# Altium schematic sheet P06_LED, Config.SchDoc
size 386 x 246 mm
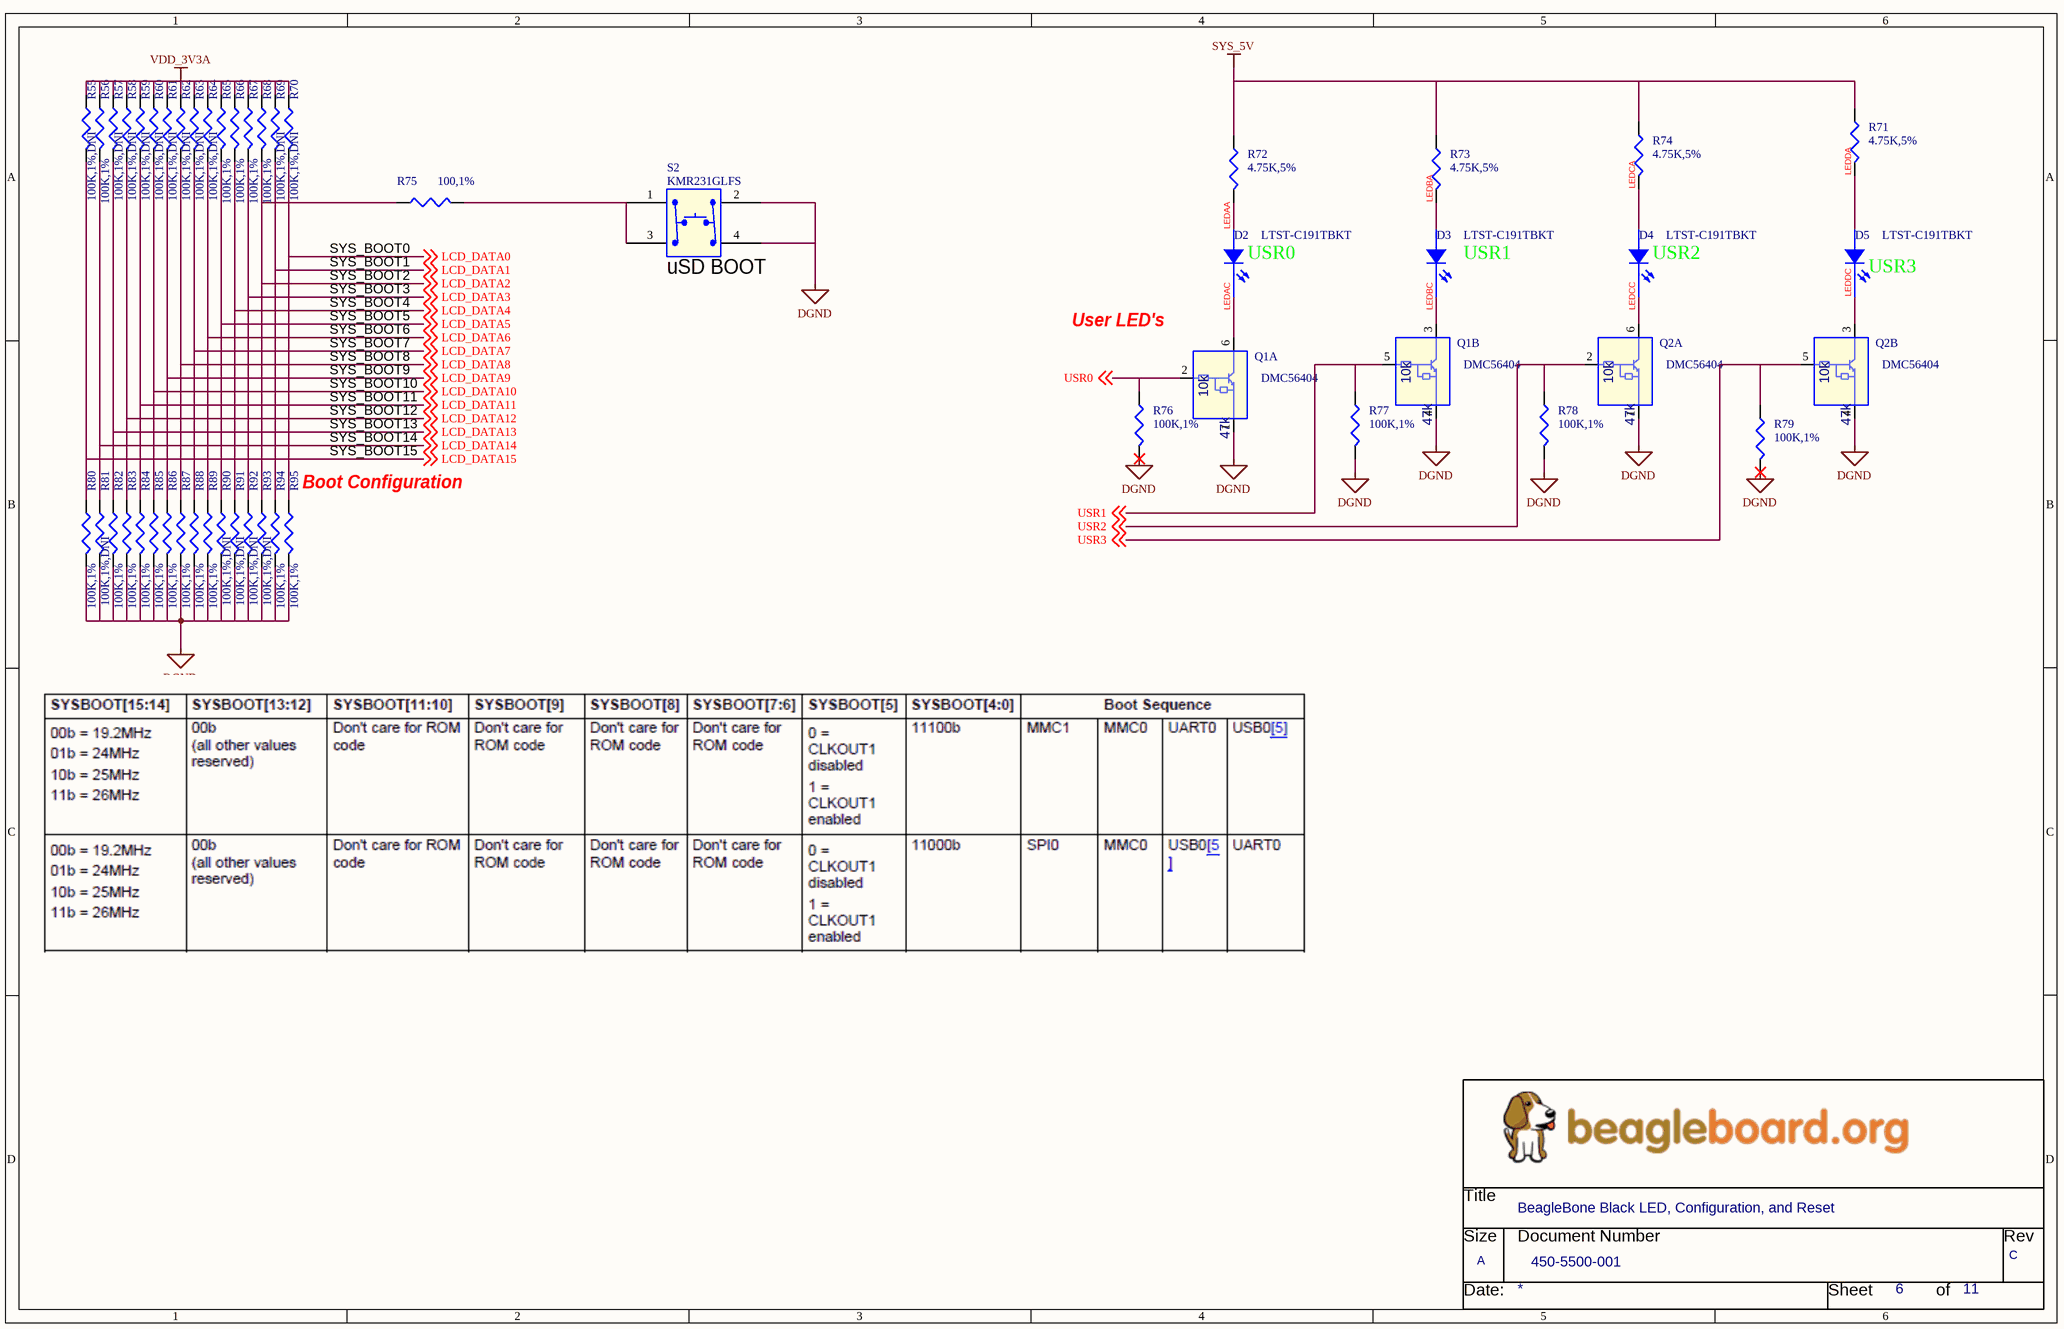
[diagram p0: P06_LED, Config.SchDoc]

## Parts
*  Page Count: 11  Page Number: 6  Page Size: A  Title: BeagleBone Black LED, Configuration, and Reset  RevCode: C  Doc: 450-5500-001  (hidden comment: BeagleBoard_org)  (graphical)
D2  LTST-C191TBKT  [led1206-59x59]
D3  LTST-C191TBKT  [led1206-59x59]
D4  LTST-C191TBKT  [led1206-59x59]
D5  LTST-C191TBKT  [led1206-59x59]
Q1  DMC56404  [P-SOT363-6-1]  (parts A,B of 2)
Q2  DMC56404  [P-SOT363-6-1]  (parts A,B of 2)
R55  100K,1%,DNI  [402]
R56  100K,1%  [402]
R57  100K,1%,DNI  [402]
R58  100K,1%,DNI  [402]
R59  100K,1%,DNI  [402]
R60  100K,1%,DNI  [402]
R61  100K,1%,DNI  [402]
R62  100K,1%,DNI  [402]
R63  100K,1%,DNI  [402]
R64  100K,1%,DNI  [402]
R65  100K,1%  [402]
R66  100K,1%  [402]
R67  100K,1%  [402]
R68  100K,1%  [402]
R69  100K,1%,DNI  [402]
R70  100K,1%,DNI  [402]
R71  4.75K,5%  [402]
R72  4.75K,5%  [402]
R73  4.75K,5%  [402]
R74  4.75K,5%  [402]
R75  100,1%  [402]
R76  100K,1%  [402]
R77  100K,1%  [402]
R78  100K,1%  [402]
R79  100K,1%  [402]
R80  100K,1%  [402]
R81  100K,1%,DNI  [402]
R82  100K,1%  [402]
R83  100K,1%  [402]
R84  100K,1%  [402]
R85  100K,1%  [402]
R86  100K,1%  [402]
R87  100K,1%  [402]
R88  100K,1%  [402]
R89  100K,1%  [402]
R90  100K,1%,DNI  [402]
R91  100K,1%,DNI  [402]
R92  100K,1%,DNI  [402]
R93  100K,1%,DNI  [402]
R94  100K,1%  [402]
R95  100K,1%  [402]
S2  KMR231GLFS  [SM-SW-SPST-4-4]

## Nets
DGND: Q1.1 Q1.4 Q2.1 Q2.4 R76.2 R77.2 R78.2 R79.2 R80.2 R81.2 R82.2 R83.2 R84.2 R85.2 R86.2 R87.2 R88.2 R89.2 R90.2 R91.2 R92.2 R93.2 R94.2 R95.2 S2.2(B1) S2.4(B2)
SYS_5V: R71.1 R72.1 R73.1 R74.1
VDD_3V3A: R55.1 R56.1 R57.1 R58.1 R59.1 R60.1 R61.1 R62.1 R63.1 R64.1 R65.1 R66.1 R67.1 R68.1 R69.1 R70.1
LCD_DATA0: R70.2 R95.1 ; off-sheet LCD_DATA0
LCD_DATA1: R69.2 R94.1 ; off-sheet LCD_DATA1
LCD_DATA2: R68.2 R75.1 R93.1 ; off-sheet LCD_DATA2
LCD_DATA3: R67.2 R92.1 ; off-sheet LCD_DATA3
LCD_DATA4: R66.2 R91.1 ; off-sheet LCD_DATA4
LCD_DATA5: R65.2 R90.1 ; off-sheet LCD_DATA5
LCD_DATA6: R64.2 R89.1 ; off-sheet LCD_DATA6
LCD_DATA7: R63.2 R88.1 ; off-sheet LCD_DATA7
LCD_DATA8: R62.2 R87.1 ; off-sheet LCD_DATA8
LCD_DATA9: R61.2 R86.1 ; off-sheet LCD_DATA9
LCD_DATA10: R60.2 R85.1 ; off-sheet LCD_DATA10
LCD_DATA11: R59.2 R84.1 ; off-sheet LCD_DATA11
LCD_DATA12: R58.2 R83.1 ; off-sheet LCD_DATA12
LCD_DATA13: R57.2 R82.1 ; off-sheet LCD_DATA13
LCD_DATA14: R56.2 R81.1 ; off-sheet LCD_DATA14
LCD_DATA15: R55.2 R80.1 ; off-sheet LCD_DATA15
LEDAA: D2.2(A) R72.2
LEDAC: D2.1(C) Q1.6
LEDBA: D3.2(A) R73.2
LEDBC: D3.1(C) Q1.3
LEDCA: D4.2(A) R74.2
LEDCC: D4.1(C) Q2.6
LEDDA: D5.2(A) R71.2
LEDDC: D5.1(C) Q2.3
USR0: Q1.2 R76.1 ; off-sheet USR0
USR1: Q1.5 R77.1 ; off-sheet USR1
USR2: Q2.2 R78.1 ; off-sheet USR2
USR3: Q2.5 R79.1 ; off-sheet USR3
NetR75_2: R75.2 S2.1(A1) S2.3(A2)

## Notes on the sheet
- (near R75) SYS_BOOT0
- SYS_BOOT1
- (near D2) USR0
- (near D3) USR1
- (near D4) USR2
- SYS_BOOT4
- SYS_BOOT2
- SYS_BOOT3
- SYS_BOOT5
- SYS_BOOT6
- (near S2) uSD BOOT
- (near Q1) User LED's
- (near D5) USR3
- SYS_BOOT8
- SYS_BOOT9
- SYS_BOOT10
- SYS_BOOT11
- SYS_BOOT7
- SYS_BOOT12
- SYS_BOOT13
- SYS_BOOT14
- SYS_BOOT15
- Boot Configuration
- (in symbol BeagleBoard_org) Title; Size; Document Number; Rev; Date:; Sheet; of
- (in symbol RN1907, part A) 10k; 47k
- (in symbol RN1907, part B) 10k; 47k

## Library data of the parts
D2-D5 = LED_LTST-C150GKT_0: TN: 257-0020-000; CLASS: DISCRETE; PCB Footprint: LED_0603
Q1 Q2 = RN1907: Manufacturer: Toshiba; ATLStockNo2: 2130.0100; ATLStockNo1: 2130.0137; Order# 2: BCR135S; PCB Footprint: SMini6-F3-B
R55-R70 R75-R95 = RES_100K_1/16W_1%_0402: Resistor 100Kohm 1/16W 1% 0402; Part Number: RES_100K_1/16W_1%_0402; PCB Footprint: 402
R71-R74 = RES_470_1/10W_5%_0402: RES 470 OHM 1/10W 5% 0402 SMD; Part Number: RES_470_1/10W_5%_0402; PCB Footprint: 402
S2 = SW_KT11P2JM_1: CLASS: DISCRETE; TN: 276-0043-000; PCB Footprint: SW4SMD_63X161LS
* = BeagleBoard_org: Page Create Date: March  8, 1995; Page Modify Date: *